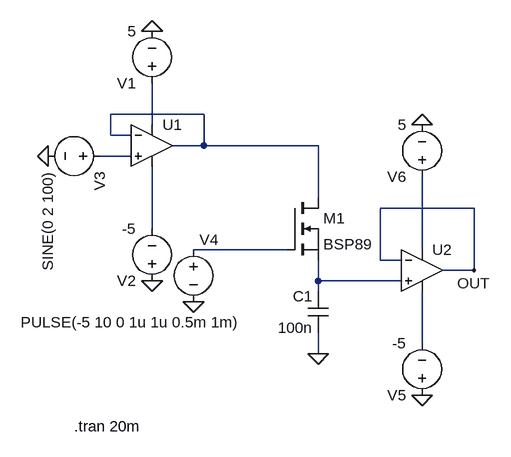
[diagram p0: schematic Draft1.asc]
Draft1.asc, the LTspice schematic file:
Version 4.1
SHEET 1 880 680
WIRE 272 128 128 128
WIRE 192 144 192 80
WIRE 128 160 128 128
WIRE 160 160 128 160
WIRE 272 176 272 128
WIRE 272 176 224 176
WIRE 448 176 272 176
WIRE 160 192 112 192
WIRE 448 256 448 176
WIRE 688 272 544 272
WIRE 192 304 192 208
WIRE 400 336 256 336
WIRE 608 336 608 224
WIRE 544 352 544 272
WIRE 576 352 544 352
WIRE 688 368 688 272
WIRE 688 368 640 368
WIRE 448 384 448 352
WIRE 576 384 448 384
WIRE 448 400 448 384
WIRE 608 480 608 400
WIRE 448 496 448 464
FLAG 192 0 0
FLAG 192 384 0
FLAG 32 192 0
FLAG 448 496 0
FLAG 256 416 0
FLAG 608 144 0
FLAG 608 560 0
FLAG 688 368 OUT
SYMBOL cap 464 464 R180
WINDOW 0 24 56 Left 2
WINDOW 3 24 8 Left 2
SYMATTR InstName C1
SYMATTR Value 100n
SYMBOL voltage 192 400 R180
WINDOW 123 0 0 Left 0
WINDOW 39 0 0 Left 0
SYMATTR InstName V2
SYMATTR Value -5
SYMBOL voltage 192 96 R180
WINDOW 123 0 0 Left 0
WINDOW 39 0 0 Left 0
SYMATTR InstName V1
SYMATTR Value 5
SYMBOL voltage 128 192 R90
WINDOW 123 0 0 Left 0
WINDOW 39 0 0 Left 0
SYMATTR InstName V3
SYMATTR Value SINE(0 2 100)
SYMBOL voltage 256 320 R0
WINDOW 0 9 1 Left 2
WINDOW 3 -266 128 Left 2
WINDOW 123 0 0 Left 0
WINDOW 39 0 0 Left 0
SYMATTR InstName V4
SYMATTR Value PULSE(-5 10 0 1u 1u 0.5m 1m)
SYMBOL voltage 608 576 R180
WINDOW 123 0 0 Left 0
WINDOW 39 0 0 Left 0
SYMATTR InstName V5
SYMATTR Value -5
SYMBOL voltage 608 240 R180
WINDOW 123 0 0 Left 0
WINDOW 39 0 0 Left 0
SYMATTR InstName V6
SYMATTR Value 5
SYMBOL nmos 400 256 R0
SYMATTR InstName M1
SYMATTR Value BSP89
SYMBOL OpAmps\\UniversalOpAmp 192 176 R0
SYMATTR InstName U1
SYMBOL OpAmps\\UniversalOpAmp 608 368 R0
SYMATTR InstName U2
TEXT 72 608 Left 2 !.tran 20m

The netlist it stands for:
* Draft1.asc
C1 0 N007 100n
V2 0 N004 -5
V1 N002 0 5
V3 N003 0 SINE(0 2 100)
V4 N005 0 PULSE(-5 10 0 1u 1u 0.5m 1m)
V5 0 N008 -5
V6 N006 0 5
M1 N001 N005 N007 N007 BSP89
X§U1 N003 N001 N002 N004 N001 level1 Avol=1Meg GBW=10Meg Vos=0 En=0 Enk=0 In=0 Ink=0 Rin=500Meg  ; pins In+ In- V+ V- OUT
X§U2 N007 OUT N006 N008 OUT level1 Avol=1Meg GBW=10Meg Vos=0 En=0 Enk=0 In=0 Ink=0 Rin=500Meg  ; pins In+ In- V+ V- OUT
.model NMOS NMOS
.model PMOS PMOS
.lib standard.mos
.tran 20m
.lib UniversalOpAmp1.lib
.backanno
.end